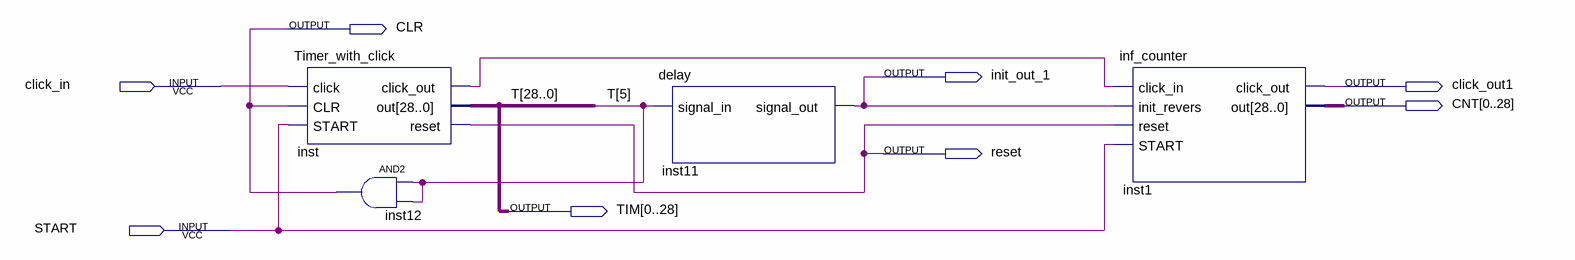
[diagram p0: schematic sheet]
// Quartus schematic inf_timer.bdf as structural Verilog: 4 symbols, 8 pins
module inf_timer (
  input  click_in,
  input  START,
  output CLR,
  output init_out_1,
  output click_out1,
  output [0:28] CNT,
  output reset,
  output [0:28] TIM
);

  wire inst_click_out;

  Timer_with_click inst (
    .click(click_in), .CLR(CLR), .START(START), .click_out(inst_click_out), .out(TIM), .reset(reset));
  and inst12 (CLR, TIM[23], TIM[23]);
  delay inst11 (.signal_in(TIM[23]), .signal_out(init_out_1));
  inf_counter inst1 (
    .click_in(inst_click_out), .init_revers(init_out_1), .reset(reset), .START(START),
    .click_out(click_out1), .out(CNT));

  // Other names for the same wires on the sheet: T[28:0] = TIM
endmodule
